# EAGLE schematic Software Switch Module (EAGLE 7.7.0)
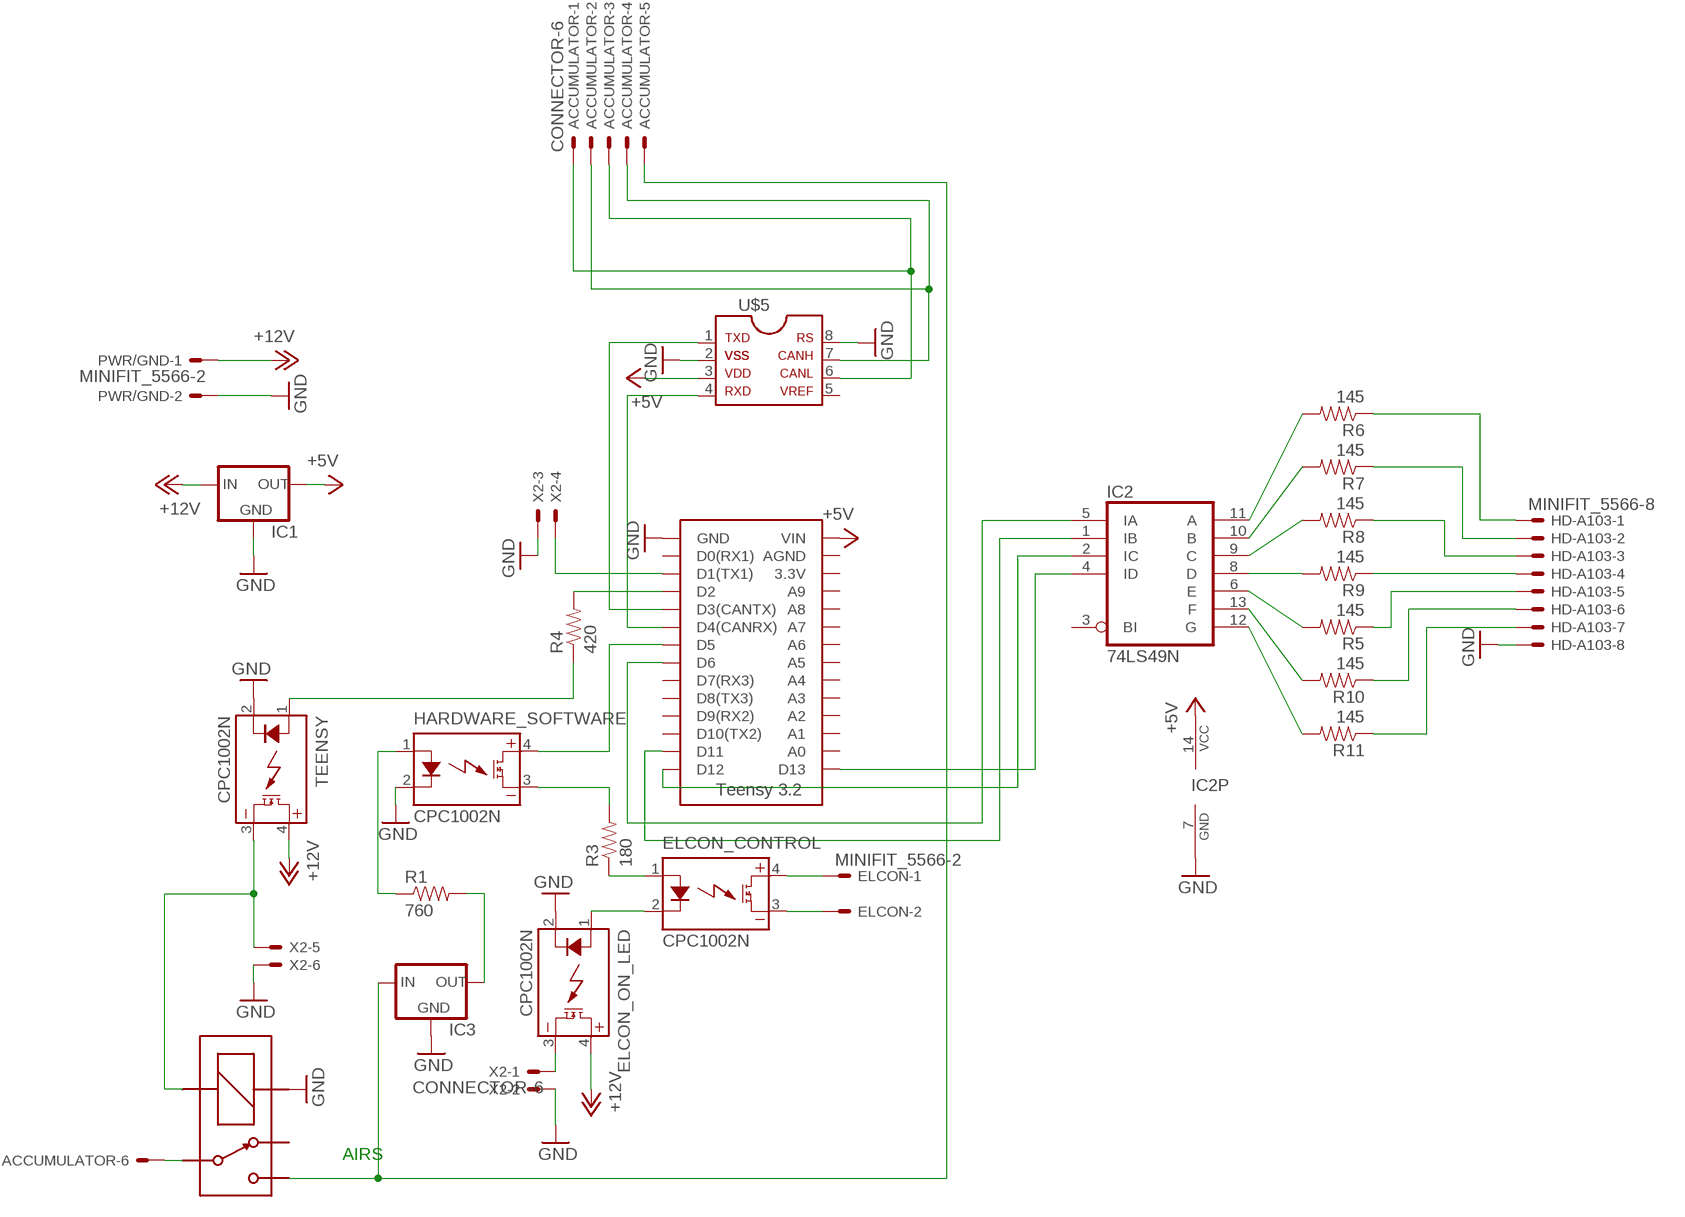
[diagram p0: schematic, sheet 1]

## Parts
ACCUMULATOR  CONNECTOR-6  [MINIFIT_5566-6]
ELCON  MINIFIT_5566-2  [MINIFIT_5566-2]
ELCON_CONTROL  CPC1002N  [SOP04]
ELCON_ON_LED  CPC1002N  [SOP04]
HARDWARE_SOFTWARE  CPC1002N  [SOP04]
HD-A103  MINIFIT_5566-8  [MINIFIT_5566-8]
IC1  5VREG_L7805_VERT  [TO-220]
IC2  74LS49N  [DIL14]
IC3  5VREG_L7805_VERT  [TO-220]
PWR/GND  MINIFIT_5566-2  [MINIFIT_5566-2]
R1  760  RESISTORAXIAL-0.3  [AXIAL-0.3]
R3  180  RESISTOREZ  [AXIAL-0.3EZ]
R4  420  RESISTOREZ  [AXIAL-0.3EZ]
R5  145  RESISTOREZ  [AXIAL-0.3EZ]
R6  145  RESISTOREZ  [AXIAL-0.3EZ]
R7  145  RESISTOREZ  [AXIAL-0.3EZ]
R8  145  RESISTOREZ  [AXIAL-0.3EZ]
R9  145  RESISTOREZ  [AXIAL-0.3EZ]
R10  145  RESISTOREZ  [AXIAL-0.3EZ]
R11  145  RESISTOREZ  [AXIAL-0.3EZ]
TEENSY  CPC1002N  [SOP04]
U$1  TEENSY_3.2_SIMPLE  [TEENSY_3.2_SIMPLE]
U$2  G5LE  [ZF112]
U$5  MCP2551  [SOIC-08]
X2  CONNECTOR-6  [MINIFIT_5566-6]

## Nets
+5V: IC1.3(OUT) IC2.14(VCC) U$1.VIN U$5.3
+12V: ELCON_ON_LED.4(DC+) IC1.1(IN) PWR/GND.1 TEENSY.4(DC+)
AIRS: ACCUMULATOR.5 IC3.1(IN) U$2.S
GND: ELCON_ON_LED.2(CONTROL-) HARDWARE_SOFTWARE.2(CONTROL-) HD-A103.8 IC1.2(GND) IC2.7(GND) IC3.2(GND) PWR/GND.2 TEENSY.2(CONTROL-) U$1.GND U$2.1(COIL+) U$5.2 U$5.8 X2.2 X2.3 X2.6
N$1: R4.P$1 TEENSY.1(CONTROL+)
N$2: HARDWARE_SOFTWARE.1(CONTROL+) R1.P$1
N$3: HARDWARE_SOFTWARE.4(DC+) U$1.D5
N$4: ACCUMULATOR.6 U$2.P
N$5: IC3.3(OUT) R1.P$2
N$7: ELCON_CONTROL.1(CONTROL+) R3.P$1
N$8: ELCON.1 ELCON_CONTROL.4(DC+)
N$9: ELCON.2 ELCON_CONTROL.3(DC-)
N$11: U$1.D1(TX1) X2.4
N$15: U$1.D4(CANRX) U$5.4
N$16: R4.P$2 U$1.D2
N$18: U$1.D3(CANTX) U$5.1
N$19: ACCUMULATOR.1 ACCUMULATOR.3 U$5.6
N$20: TEENSY.3(DC-) U$2.2(COIL-) X2.5
N$21: IC2.11(A) R6.P$2
N$23: HARDWARE_SOFTWARE.3(DC-) R3.P$2
N$28: ELCON_CONTROL.2(CONTROL-) ELCON_ON_LED.1(CONTROL+)
N$30: ELCON_ON_LED.3(DC-) X2.1
N$32: IC2.5(IA) U$1.D6
N$33: IC2.1(IB) U$1.D11
N$34: IC2.4(ID) U$1.D13
N$35: IC2.2(IC) U$1.D12
N$36: IC2.10(B) R7.P$2
N$37: IC2.9(C) R8.P$2
N$38: IC2.8(D) R9.P$2
N$39: IC2.13(F) R10.P$2
N$40: IC2.12(G) R11.P$2
N$41: IC2.6(E) R5.P$2
N$42: HD-A103.1 R6.P$1
N$43: ACCUMULATOR.2 ACCUMULATOR.4 U$5.7
N$44: HD-A103.2 R7.P$1
N$45: HD-A103.3 R8.P$1
N$46: HD-A103.4 R9.P$1
N$47: HD-A103.5 R5.P$1
N$48: HD-A103.6 R10.P$1
N$49: HD-A103.7 R11.P$1
Unconnected: IC2.3(BI) U$1.3.3V U$1.A0 U$1.A1 U$1.A2 U$1.A3 U$1.A4 U$1.A5 U$1.A6 U$1.A7 U$1.A8 U$1.A9 U$1.AGND U$1.D0(RX1) U$1.D7(RX3) U$1.D8(TX3) U$1.D9(RX2) U$1.D10(TX2) U$2.O U$5.5

## Notes on the sheet
- AIRS

## Library data of the parts
ACCUMULATOR X2 = HyTechDevices:CONNECTOR-6: Mini-Fit Junior connector 6 pole Source: http://www.molex.com; MPN: 95566-61002; OC_FARNELL: unknown; OC_NEWARK: 22K8620
ELCON PWR/GND = HyTechDevices:MINIFIT_5566-2: Mini-Fit Junior connector 2 pole Source: http://www.molex.com; OC_FARNELL: 1822072; OC_NEWARK: unknown
ELCON_CONTROL ELCON_ON_LED HARDWARE_SOFTWARE TEENSY = HyTechDevices:CPC1002N: IXYS Solid State Relay .7A
HD-A103 = HyTechDevices:MINIFIT_5566-8: Mini-Fit Junior connector 8 pole Source: http://www.molex.com; OC_FARNELL: unknown; OC_NEWARK: unknown
IC1 IC3 = HyTechDevices:5VREG_L7805: Voltage Regulator Switching 5v regulator Datasheet <http://power.murata.com/data/power/oki-78sr.pdf> Standard 7805 5V regulator. IGO (Input Ground Output). Spark Fun Electronics SKU : COM-00107 Datasheet <http://www.mouser.com/ds/2/308/MC7800-D-94905.pdf>
IC2 = 74xx-us:74*49: BCD to seven segment DECODER/DRIVER, open collector
R1 R3-R11 = HyTechDevices:RESISTOR: Resistor Basic schematic elements and footprints for 0603, 1206, and PTH resistors.
U$1 = HyTechDevices:TEENSY_3.2_SIMPLE: Simple version of the Teensy 3.2 board that only uses the 2 main rows of pins, not the inner pins or the pins opposite the usb port.
U$2 = HyTechDevices:G5LE: Omron G5LE SPST Relay 5 VDC, 12VDC, 24VDC models Coil voltage: 75% - 170% of nominal voltage Datasheet <https://www.omron.com/ecb/products/pdf/en-g5le.pdf>
U$5 = HyTechDevices:MCP2551: MCP2551 High-Speed CAN Transceiver Product Webpage <https://www.microchip.com/wwwproducts/en/MCP2551> Datasheet <http://ww1.microchip.com/downloads/en/DeviceDoc/21667f.pdf> This device is outdated It is replaced by MCP2561. Comparison Page <https://www.microchip.com/wwwproducts/ProductCompare/MCP2551/MCP2561> Product Webpage <https://www.microchip.com/wwwproducts/en/MCP2561> Datasheet <http://ww1.microchip.com/downloads/en/DeviceDoc/20005167C.pdf>